# Altium schematic sheet inhibits.SchDoc
size 297 x 209 mm
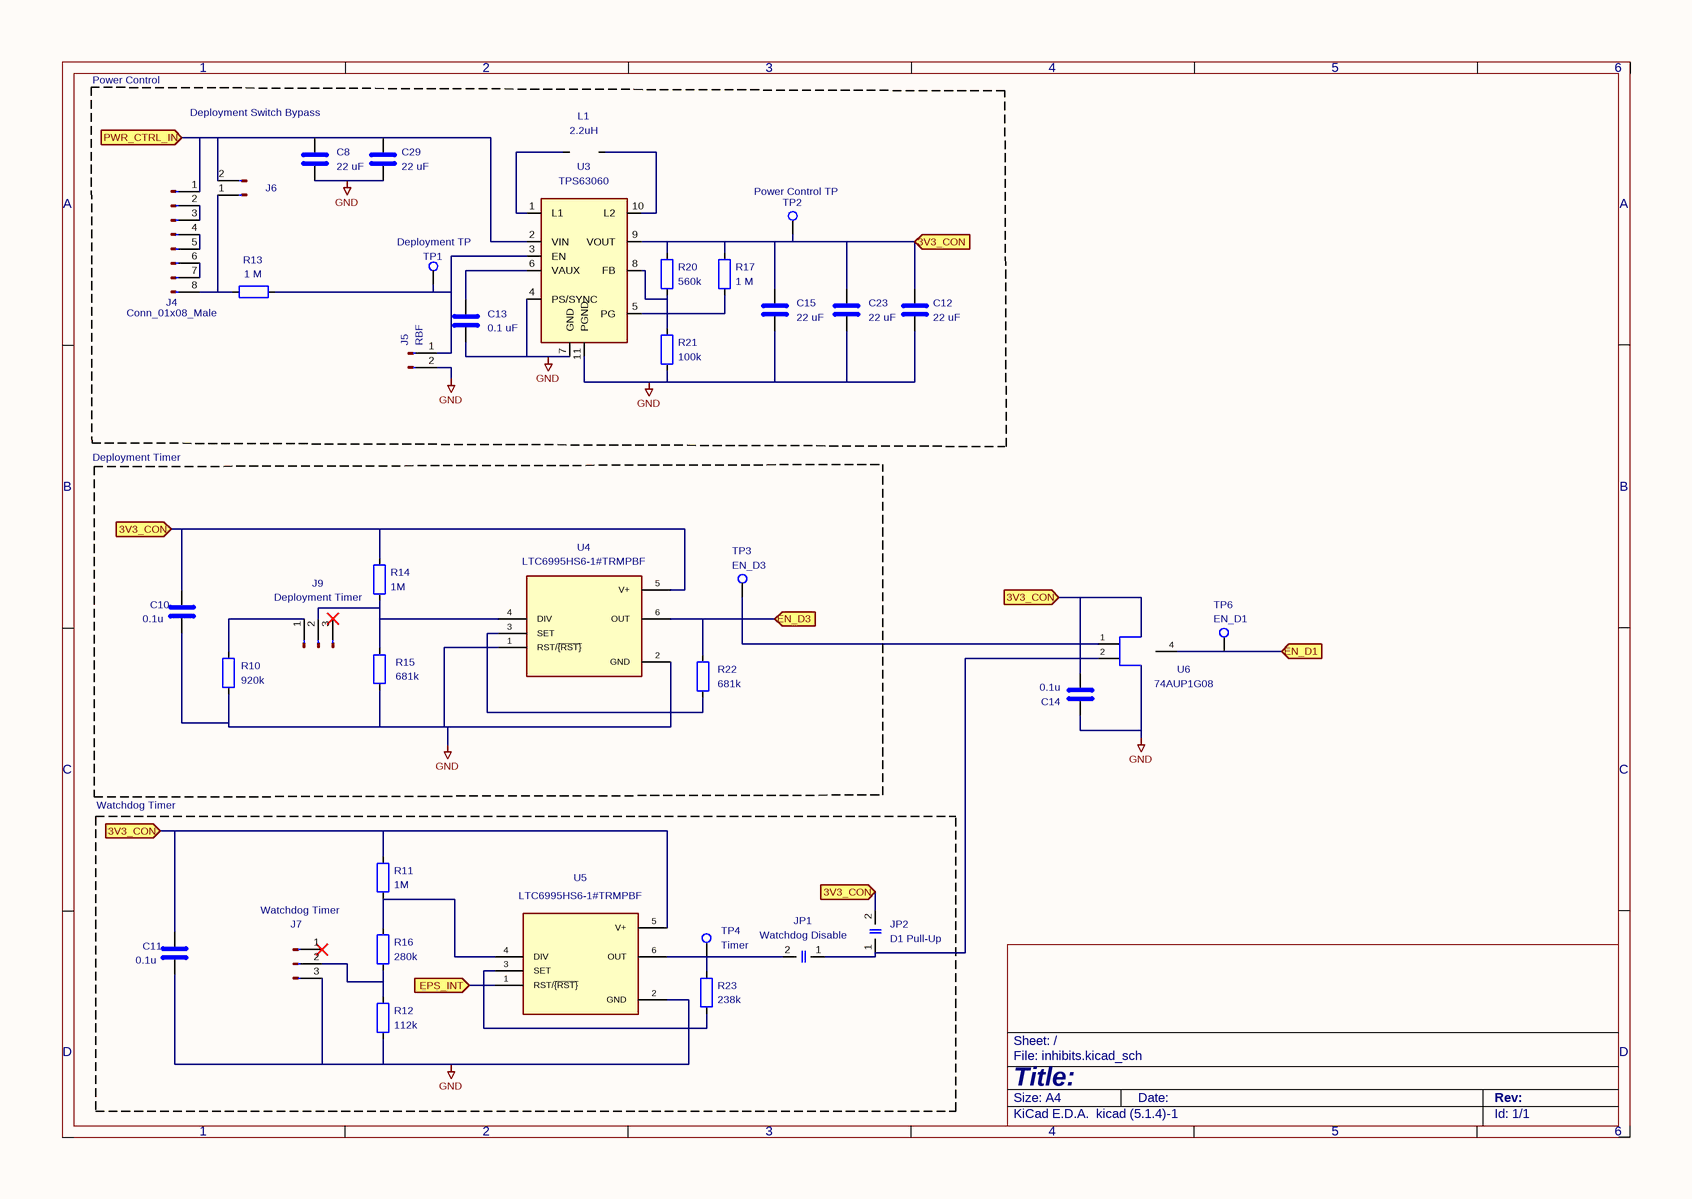
[diagram p0: inhibits.SchDoc]

## Parts
C8  22 uF  [C_0402_1005Metric]
C10  0.1u  [C_0402_1005Metric]
C11  0.1u  [C_0402_1005Metric]
C12  22 uF  [C_0402_1005Metric]
C13  0.1 uF  [C_0402_1005Metric]
C14  0.1u  [C_0603_1608Metric]
C15  22 uF  [C_0402_1005Metric]
C23  22 uF  [C_0402_1005Metric]
C29  22 uF  [C_0402_1005Metric]
J4  Conn_01x08_Male  [M80-5300842]
J5  RBF  [PinHeader_1x02_P2.00mm_Horizontal]
J6  Deployment Switch Bypass  [PinHeader_1x02_P2.00mm_Horizontal]
J7  Watchdog Timer  [PinHeader_1x03_P2.00mm_Horizontal]
J9  Deployment Timer  [PinHeader_1x03_P2.00mm_Horizontal]
JP1  Watchdog Disable  [SolderJumper-2_P1.3mm_Open_Pad1.0x1.5mm]
JP2  D1 Pull-Up  [SolderJumper-2_P1.3mm_Open_Pad1.0x1.5mm]
L1  2.2uH  [L_0805_2012Metric_Pad1.15x1.40mm_HandSolder]
R10  920k  [R_0402_1005Metric]
R11  1M  [R_0402_1005Metric]
R12  112k  [R_0402_1005Metric]
R13  1 M  [R_0603_1608Metric]
R14  1M  [R_0402_1005Metric]
R15  681k  [R_0402_1005Metric]
R16  280k  [R_0402_1005Metric]
R17  1 M  [R_0402_1005Metric]
R20  560k  [R_0402_1005Metric]
R21  100k  [R_0402_1005Metric]
R22  681k  [R_0402_1005Metric]
R23  238k  [R_0402_1005Metric]
TP1  Deployment TP  [TestPoint_THTPad_D2.0mm_Drill1.0mm]
TP2  Power Control TP  [TestPoint_THTPad_D2.0mm_Drill1.0mm]
TP3  EN_D3  [TestPoint_THTPad_D2.0mm_Drill1.0mm]
TP4  Timer  [TestPoint_THTPad_D2.0mm_Drill1.0mm]
TP6  EN_D1  [TestPoint_THTPad_D2.0mm_Drill1.0mm]
U3  TPS63060  [Texas_S-PWSON-N10_ThermalVias]
U4  LTC6995HS6-1#TRMPBF  [DFN-6_DCB_LIT]
U5  LTC6995HS6-1#TRMPBF  [DFN-6_DCB_LIT]
U6  74AUP1G08  [SOT-353_SC-70-5_Handsoldering]

## Blocks framed on the sheet
Power Control: C8 C12 C13 C15 C23 C29 J4-J6 L1 R13 R17 R20 R21 TP1 TP2 U3
Deployment Timer: C10 J9 R10 R14 R15 R22 TP3 U4
Watchdog Timer: C11 J7 JP1 JP2 R11 R12 R16 R23 TP4 U5

## Ports
3V3_CON (in), EN_D1 (in), EN_D3 (in), EPS_INT (in), PWR_CTRL_IN (in)

## Nets
GND: C8.2 C10.2 C11.2 C12.2 C13.2 C14.1 C15.2 C23.2 C29.2 J5.2(Pin_2) J7.3(Pin_3) R10.2 R12.2 R15.2 R21.2 U3.4(PS/SYNC) U3.7(GND) U3.11(PGND) U4.1(RST/~{{RST}}) U4.2(GND) U5.2(GND)
3V3_CON: C10.1 C11.1 C12.1 C14.2 C15.1 C23.1 JP2.2(B) R11.1 R14.1 R17.1 R20.1 TP2.1 U3.9(VOUT) U4.5(V+) U5.5(V+) ; port 3V3_CON
EN_D1: TP6.1 U6.4 ; port EN_D1
EN_D3: R22.1 TP3.1 U4.6(OUT) U6.1 ; port EN_D3
EPS_INT: U5.1(RST/~{{RST}}) ; port EPS_INT
PWR_CTRL_IN: C8.1 C29.1 J4.1(Pin_1) J6.2(Pin_2) U3.2(VIN) ; port PWR_CTRL_IN
NetC13_1: C13.1 U3.6(VAUX)
NetJ4_2: J4.2(Pin_2) J4.3(Pin_3)
NetJ4_4: J4.4(Pin_4) J4.5(Pin_5)
NetJ4_6: J4.6(Pin_6) J4.7(Pin_7)
NetJ4_8: J4.8(Pin_8) J6.1(Pin_1) R13.1
NetJ5_1: J5.1(Pin_1) R13.2 TP1.1 U3.3(EN)
NetJ7_2: J7.2(Pin_2) R12.1 R16.2
NetJ9_1: J9.1(Pin_1) R10.1
NetJ9_2: J9.2(Pin_2) R14.2 R15.1 U4.4(DIV)
NetJP1_1: JP1.1(A) JP2.1(A) U6.2
NetJP1_2: JP1.2(B) R23.1 TP4.1 U5.6(OUT)
NetL1_1: L1.1 U3.1(L1)
NetL1_2: L1.2 U3.10(L2)
NetR11_2: R11.2 R16.1 U5.4(DIV)
NetR17_2: R17.2 U3.5(PG)
NetR20_2: R20.2 R21.1 U3.8(FB)
NetR22_2: R22.2 U4.3(SET)
NetR23_2: R23.2 U5.3(SET)

Not connected (* = marked no-connect by the designer): J7 1(Pin_1)*; J9 3(Pin_3)*; U6 3(GND) 5(VCC)

## Notes on the sheet
- 1
- 2
- 3
- 4
- 5
- 6
- A
- B
- C
- D
- Title:
- File: inhibits.kicad_sch
- Sheet: /
- KiCad E.D.A.  kicad (5.1.4)-1
- Size: A4
- Date:
- Rev:
- Id: 1/1

## Library data of the parts
C8 C10-C15 C23 C29 = C
  C8 C12 C15 C23 C29: Value: 22 uF; Footprint: Capacitor_SMD:C_0402_1005Metric
  C10 C11: Value: 0.1u; Footprint: Capacitor_SMD:C_0402_1005Metric
  C13: Value: 0.1 uF; Footprint: Capacitor_SMD:C_0402_1005Metric
  C14: Value: 0.1u; Footprint: Capacitor_SMD:C_0603_1608Metric
J5 J6 = Conn_01x02_Male: Footprint: Connector_PinHeader_2.00mm:PinHeader_1x02_P2.00mm_Horizontal
  J5: Value: RBF
  J6: Value: Deployment Switch Bypass
J7 J9 = Conn_01x03_Male: Footprint: Connector_PinHeader_2.00mm:PinHeader_1x03_P2.00mm_Horizontal
  J7: Value: Watchdog Timer
  J9: Value: Deployment Timer
JP1 JP2 = SolderJumper_2_Open: Footprint: Jumper:SolderJumper-2_P1.3mm_Open_Pad1.0x1.5mm
  JP1: Value: Watchdog Disable
  JP2: Value: D1 Pull-Up
L1 = L: Value: 2.2uH; Footprint: Inductor_SMD:L_0805_2012Metric_Pad1.15x1.40mm_HandSolder
R10-R17 R20-R23 = R
  R10: Value: 920k; Footprint: Resistor_SMD:R_0402_1005Metric
  R11 R14: Value: 1M; Footprint: Resistor_SMD:R_0402_1005Metric
  R12: Value: 112k; Footprint: Resistor_SMD:R_0402_1005Metric
  R13: Value: 1 M; Footprint: Resistor_SMD:R_0603_1608Metric
  R15 R22: Value: 681k; Footprint: Resistor_SMD:R_0402_1005Metric
  R16: Value: 280k; Footprint: Resistor_SMD:R_0402_1005Metric
  R17: Value: 1 M; Footprint: Resistor_SMD:R_0402_1005Metric
  R20: Value: 560k; Footprint: Resistor_SMD:R_0402_1005Metric
  R21: Value: 100k; Footprint: Resistor_SMD:R_0402_1005Metric
  R23: Value: 238k; Footprint: Resistor_SMD:R_0402_1005Metric
TP1-TP4 TP6 = TestPoint: Footprint: TestPoint:TestPoint_THTPad_D2.0mm_Drill1.0mm
  TP1: Value: Deployment TP
  TP2: Value: Power Control TP
  TP3: Value: EN_D3
  TP4: Value: Timer
  TP6: Value: EN_D1
U4 U5 = LTC6995HS6-1#TRMPBF: MANUFACTURER: Analog Devices Inc.; PARTREV: Rev. B; STANDARD: IPC 7351B; MAXIMUM_PACKAGE_HEIGHT: 1.0mm; Value: LTC6995HS6-1#TRMPBF; Footprint: qset-footprints:DFN-6_DCB_LIT
J4 = Conn_01x08_Male: Value: Conn_01x08_Male; Footprint: qset-footprints:M80-5300842
U3 = TPS63060: Value: TPS63060; Footprint: Package_SON:Texas_S-PWSON-N10_ThermalVias
U6 = 74AUP1G08: Value: 74AUP1G08; Footprint: Package_TO_SOT_SMD:SOT-353_SC-70-5_Handsoldering